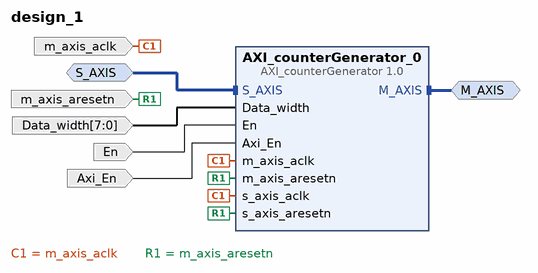
[diagram p0: block diagram of the top level]
# Vivado block design design_1, xc7z010clg400-1, Vivado 2017.2
create_bd_design design_1

create_bd_intf_port -mode Slave -vlnv xilinx.com:interface:axis_rtl:1.0 S_AXIS
set_property -dict [list \
  CONFIG.TDATA_NUM_BYTES 4 \
  CONFIG.TDEST_WIDTH 0 \
  CONFIG.TID_WIDTH 0 \
  CONFIG.TUSER_WIDTH 0 \
  CONFIG.HAS_TREADY 1 \
  CONFIG.HAS_TSTRB 1 \
  CONFIG.HAS_TKEEP 0 \
  CONFIG.HAS_TLAST 1 \
  CONFIG.LAYERED_METADATA undef \
] [get_bd_intf_ports S_AXIS]
create_bd_intf_port -mode Master -vlnv xilinx.com:interface:axis_rtl:1.0 M_AXIS
create_bd_port -dir I -from 7 -to 0 Data_width
create_bd_port -dir I En
create_bd_port -dir I Axi_En
create_bd_port -dir I -type clk m_axis_aclk
set_property -dict {CONFIG.FREQ_HZ 100000000} [get_bd_ports m_axis_aclk]
create_bd_port -dir I -type rst m_axis_aresetn

create_bd_cell -type ip -vlnv xilinx.com:user:AXI_counterGenerator:1.0 AXI_counterGenerator_0

# ---- connections ----

connect_bd_intf_net [get_bd_intf_ports S_AXIS] [get_bd_intf_pins AXI_counterGenerator_0/S_AXIS]
connect_bd_intf_net [get_bd_intf_ports M_AXIS] [get_bd_intf_pins AXI_counterGenerator_0/M_AXIS]
connect_bd_net [get_bd_ports Data_width] [get_bd_pins AXI_counterGenerator_0/Data_width]
connect_bd_net [get_bd_ports En] [get_bd_pins AXI_counterGenerator_0/En]
connect_bd_net [get_bd_ports Axi_En] [get_bd_pins AXI_counterGenerator_0/Axi_En]
connect_bd_net [get_bd_ports m_axis_aclk] [get_bd_pins AXI_counterGenerator_0/m_axis_aclk] [get_bd_pins AXI_counterGenerator_0/s_axis_aclk]
connect_bd_net [get_bd_ports m_axis_aresetn] [get_bd_pins AXI_counterGenerator_0/m_axis_aresetn] [get_bd_pins AXI_counterGenerator_0/s_axis_aresetn]

validate_bd_design
save_bd_design
